# EAGLE schematic Potencia (EAGLE 7.5.0)
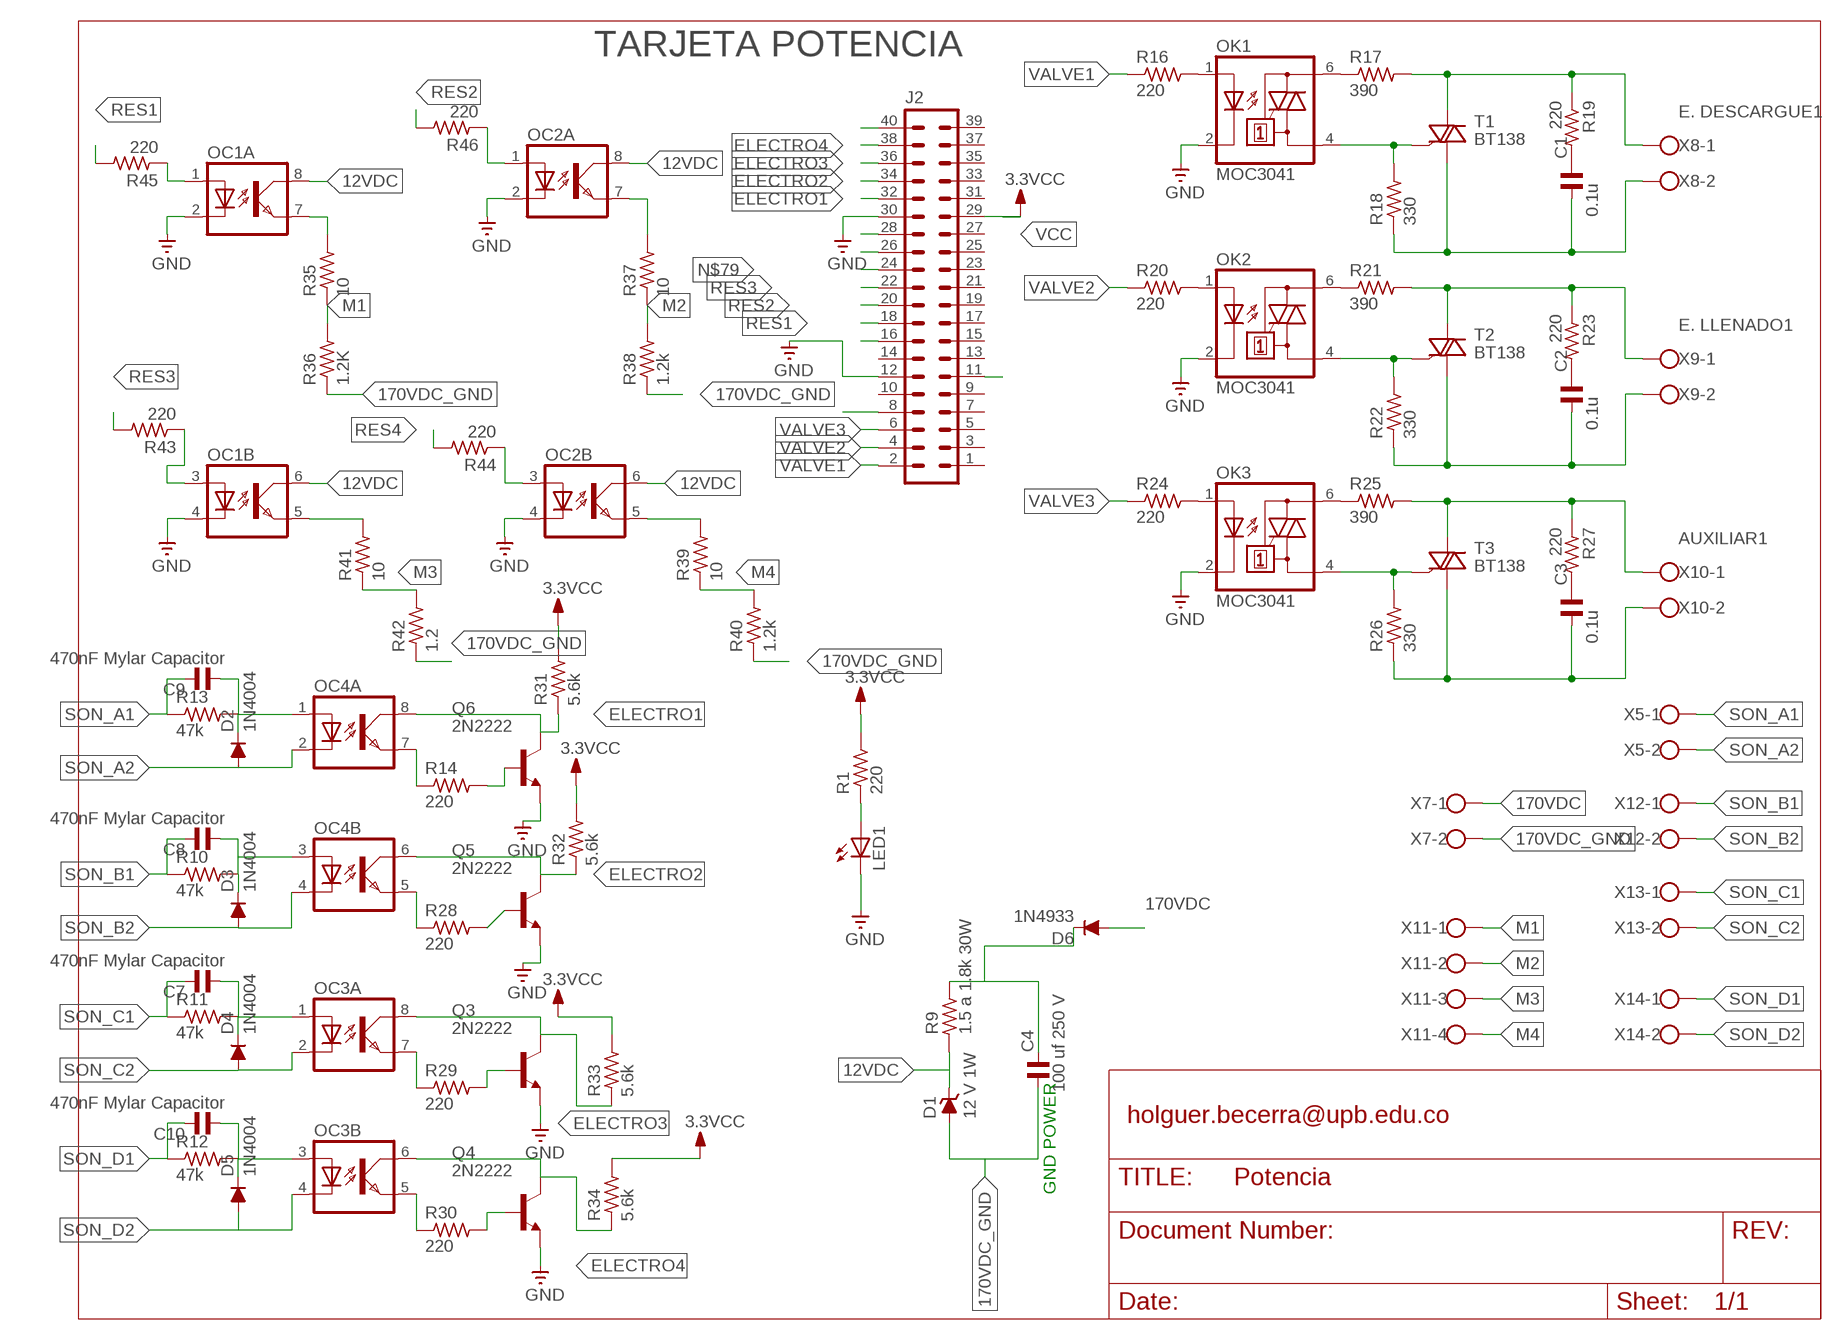
[diagram p0: schematic, sheet 1]

## Parts
C1  0.1u  C-US075-042X103  [C075-042X103]
C2  0.1u  C-US075-042X103  [C075-042X103]
C3  0.1u  C-US075-042X103  [C075-042X103]
C4  100 uf 250 V  C2.5/6  [C2.5-6]
C7  470nF Mylar Capacitor  C2,5-3  [C2.5-3]
C8  470nF Mylar Capacitor  C2,5-3  [C2.5-3]
C9  470nF Mylar Capacitor  C2,5-3  [C2.5-3]
C10  470nF Mylar Capacitor  C2,5-3  [C2.5-3]
D1  12 V 1W  ZENER-DIODEC1702-15  [C1702-15]
D2  1N4004  [DO41-10]
D3  1N4004  [DO41-10]
D4  1N4004  [DO41-10]
D5  1N4004  [DO41-10]
D6  1N4933  [DO41-10]
J2  ML40  [ML40]
LED1  LED  [SMARTLED-TTW]
OC1  ILD621  [DIL08]
OC2  ILD621  [DIL08]
OC3  ILD621  [DIL08]
OC4  ILD621  [DIL08]
OK1  MOC3041  MOC3041M  [DIL06]
OK2  MOC3041  MOC3041M  [DIL06]
OK3  MOC3041  MOC3041M  [DIL06]
Q3  2N2222  [TO18]
Q4  2N2222  [TO18]
Q5  2N2222  [TO18]
Q6  2N2222  [TO18]
R1  220  R-US_R0603  [R0603]
R9  1.5 a 1.8k 30W  RCR15  [CR15]
R10  47k  R-US_R0603  [R0603]
R11  47k  R-US_R0603  [R0603]
R12  47k  R-US_R0603  [R0603]
R13  47k  R-US_R0603  [R0603]
R14  220  R-US_R0603  [R0603]
R16  220  R-US_R0603  [R0603]
R17  390  R-US_0207/7  [0207/7]
R18  330  R-US_0207/7  [0207/7]
R19  220  R-US_0309/10  [0309/10]
R20  220  R-US_R0603  [R0603]
R21  390  R-US_0207/7  [0207/7]
R22  330  R-US_0207/7  [0207/7]
R23  220  R-US_0309/10  [0309/10]
R24  220  R-US_R0603  [R0603]
R25  390  R-US_0207/7  [0207/7]
R26  330  R-US_0207/7  [0207/7]
R27  220  R-US_0309/10  [0309/10]
R28  220  R-US_R0603  [R0603]
R29  220  R-US_R0603  [R0603]
R30  220  R-US_R0603  [R0603]
R31  5.6k  R-US_R0603  [R0603]
R32  5.6k  R-US_R0603  [R0603]
R33  5.6k  R-US_R0603  [R0603]
R34  5.6k  R-US_R0603  [R0603]
R35  10  R-US_R0603  [R0603]
R36  1.2K  R-US_R0603  [R0603]
R37  10  R-US_R0603  [R0603]
R38  1.2k  R-US_R0603  [R0603]
R39  10  R-US_R0603  [R0603]
R40  1.2k  R-US_R0603  [R0603]
R41  10  R-US_R0603  [R0603]
R42  1.2  R-US_R0603  [R0603]
R43  220  R-US_R0603  [R0603]
R44  220  R-US_R0603  [R0603]
R45  220  R-US_R0603  [R0603]
R46  220  R-US_R0603  [R0603]
T1  BT138  BT138-V  [TO220BV]
T2  BT138  BT138-V  [TO220BV]
T3  BT138  BT138-V  [TO220BV]
X5  W237-102  [W237-102]
X7  W237-102  [W237-102]
X8  E. DESCARGUE1  W237-102  [W237-102]
X9  E. LLENADO1  W237-102  [W237-102]
X10  AUXILIAR1  W237-102  [W237-102]
X11  W237-4  [W237-4]
X12  W237-102  [W237-102]
X13  W237-102  [W237-102]
X14  W237-102  [W237-102]

## Nets
5VDC: J2.11
12VDC: D1.C OC1.6(B:COL) OC1.8(A:COL) OC2.6(B:COL) OC2.8(A:COL) R9.1
170VDC: D6.A X7.1
170VDC_GND: C4.1 D1.A R36.1 R38.1 R40.1 R42.1 X7.2
DAS: C4.2 D6.C R9.2
ELECTRO1: J2.32 OC4.8(A:COL) Q6.3(C) R31.1
ELECTRO2: J2.34 OC4.6(B:COL) Q5.3(C) R32.1
ELECTRO3: J2.36 OC3.8(A:COL) Q3.3(C) R33.1
ELECTRO4: J2.38 OC3.6(B:COL) Q4.3(C) R34.1
GND: J2.12 J2.30 LED1.C@1(C) OC1.4(B:C) OC2.2(A:C) OC2.4(B:C) OK1.2(C) OK2.2(C) OK3.2(C) Q3.1(E) Q4.1(E) Q5.1(E) Q6.1(E)
M1: R35.1 R36.2 X11.1
M2: R37.1 R38.2 X11.2
M3: R41.1 R42.2 X11.3
M4: R39.1 R40.2 X11.4
N$1: LED1.A@1(A) R1.1
N$10: OK1.1(A) R16.2
N$12: OK2.1(A) R20.2
N$13: OK1.4(A1) R18.2 T1.G
N$14: OK1.6(A2) R17.1
N$15: R17.2 R19.1 T1.T2(A2) X8.1
N$16: C1.2 R18.1 T1.T1(A1) X8.2
N$17: C1.1 R19.2
N$18: OK2.4(A1) R22.2 T2.G
N$19: OK2.6(A2) R21.1
N$20: R21.2 R23.1 T2.T2(A2) X9.1
N$21: C2.2 R22.1 T2.T1(A1) X9.2
N$22: C2.1 R23.2
N$23: OK3.1(A) R24.2
N$24: OK3.4(A1) R26.2 T3.G
N$25: OK3.6(A2) R25.1
N$26: R25.2 R27.1 T3.T2(A2) X10.1
N$27: C3.2 R26.1 T3.T1(A1) X10.2
N$28: C3.1 R27.2
N$29: C9.1 D2.C OC4.1(A:A) R13.2
N$32: OC1.7(A:EMIT) R35.2
N$37: OC4.7(A:EMIT) R14.1
N$38: Q6.2(B) R14.2
N$40: OC1.5(B:EMIT) R41.2
N$41: OC1.3(B:A) R43.1
N$43: OC1.2(A:C)
N$44: OC4.5(B:EMIT) R28.1
N$45: Q5.2(B) R28.2
N$46: OC3.7(A:EMIT) R29.1
N$47: Q3.2(B) R29.2
N$48: OC3.5(B:EMIT) R30.1
N$49: Q4.2(B) R30.2
N$50: OC1.1(A:A) R45.1
N$51: C8.1 D3.C OC4.3(B:A) R10.2
N$52: OC2.1(A:A) R46.1
N$54: C7.1 D4.C OC3.1(A:A) R11.2
N$55: OC2.3(B:A) R44.1
N$56: J2.40
N$57: C10.1 D5.C OC3.3(B:A) R12.2
N$59: OC2.5(B:EMIT) R39.2
N$68: OC2.7(A:EMIT) R37.2
N$76: J2.28
N$77: J2.26
N$78: J2.24
N$79: J2.22
N$86: J2.8
RES1: J2.16 R45.2
RES2: J2.18 R46.2
RES3: J2.20 R43.2
RES4: R44.2
SON_A1: C9.2 R13.1 X5.1
SON_A2: D2.A OC4.2(A:C) X5.2
SON_B1: C8.2 R10.1 X12.1
SON_B2: D3.A OC4.4(B:C) X12.2
SON_C1: C7.2 R11.1 X13.1
SON_C2: D4.A OC3.2(A:C) X13.2
SON_D1: C10.2 R12.1 X14.1
SON_D2: D5.A OC3.4(B:C) X14.2
VALVE1: J2.2 R16.1
VALVE2: J2.4 R20.1
VALVE3: J2.6 R24.1
VCC: J2.29 R1.2 R31.2 R32.2 R33.2 R34.2 ; supply symbol labelled 3.3VCC
Unconnected: J2.1 J2.3 J2.5 J2.7 J2.9 J2.10 J2.13 J2.14 J2.15 J2.17 J2.19 J2.21 J2.23 J2.25 J2.27 J2.31 J2.33 J2.35 J2.37 J2.39

## Notes on the sheet
- TARJETA POTENCIA
- holguer.becerra@upb.edu.co
- GND POWER

## Library data of the parts
C1-C3 = rcl:C-US: CAPACITOR, American symbol
C4 C7-C10 = capacitor-wima:C: CAPACITOR naming: grid - package width
D1 = diode:ZENER-DIODE: Z-Diode
D2-D5 = diode:1N4004: DIODE general purpose rectifier, 1 A
D6 = diode:1N4933: DIODE fast recovery rectifier, 1A
J2 = con-harting-ml:ML40: HARTING
LED1 = adafruit:LED: LED OSRAM: - CHIPLED LG R971, LG N971, LY N971, LG Q971, LY Q971, LO R971, LY R971 LH N974, LH R974 LS Q976, LO Q976, LY Q976 LO Q996 - Hyper CHIPLED LW Q18S LB Q993, LB Q99A, LB R99A - SideLED LS A670, LO A670, LY A670, LG A670, LP A670 LB A673, LV A673, LT A673, LW A673 LH A674 LY A675 LS A676, LA A676, LO A676, LY A676, LW A676 LS A679, LY A679, LG A679 - Hyper Micro SIDELED® LS Y876, LA Y876, LO Y876, LY Y876 LT Y87S - SmartLED LW L88C, LW L88S LB L89C, LB L89S, LG L890 LS L89K, LO L89K, LY L89K LS L896, LA L896, LO L896, LY L896 - TOPLED LS T670, LO T670, LY T670, LG T670, LP T670 LSG T670, LSP T670, LSY T670, LOP T670, LYG T670 LG T671, LOG T671, LSG T671 LB T673, LV T673, LT T673, LW T673 LH T674 LS T676, LA T676, LO T676, LY T676, LB T676, LH T676, LSB T676, LW T676 LB T67C, LV T67C, LT T67C, LS T67K, LO T67K, LY T67K, LW E67C LS E67B, LA E67B, LO E67B, LY E67B, LB E67C, LV E67C, LT E67C LW T67C LS T679, LY T679, LG T679 LS T770, LO T770, LY T770, LG T770, LP T770 LB T773, LV T773, LT T773, LW T773 LH T774 LS E675, LA E675, LY E675, LS T675 LS T776, LA T776, LO T776, LY T776, LB T776 LHGB T686 LT T68C, LB T68C - Hyper Mini TOPLED® LB M676 - Mini TOPLED Santana® LG M470 LS M47K, LO M47K, LY M47K Source: http://www.osram.convergy.de/
OC1-OC4 = optocoupler:ILD621: SIEMENS OPTO COUPLER
OK1-OK3 = optocoupler:MOC30*: 6-Pin DIP Zero-Cross Optoisolators Triac Driver Output (250/400 Volt Peak) Source: Data sheet <http://www.fairchildsemi.com/ds/MO/MOC3031M.pdf> The old path of data sheet not more available 2013-05-06.; MF: FAIRCHILD SEMICONDUCTOR; MPN: MOC3041M; OC_FARNELL: 1086677; OC_NEWARK: 78K6090
Q3-Q6 = transistor:2N2222: NPN TRANSISTOR
R1 R10-R14 R16-R46 = rcl:R-US_: RESISTOR, American symbol
R9 = resistor-power:R: Power Resitor
T1-T3 = triac:BT138: TRIAC Source: http://www.semiconductors.philips.com BT138_SERIES_2.pdf
X5 X7-X10 X12-X14 = con-wago-500:W237-102: WAGO SCREW CLAMP
X11 = con-wago-500:W237-4: WAGO SCREW CLAMP